# Altium schematic sheet 1_RX_Ultrasonic.schdoc
size 497 x 243 mm; SheetNumber: 1; SheetTotal: 2
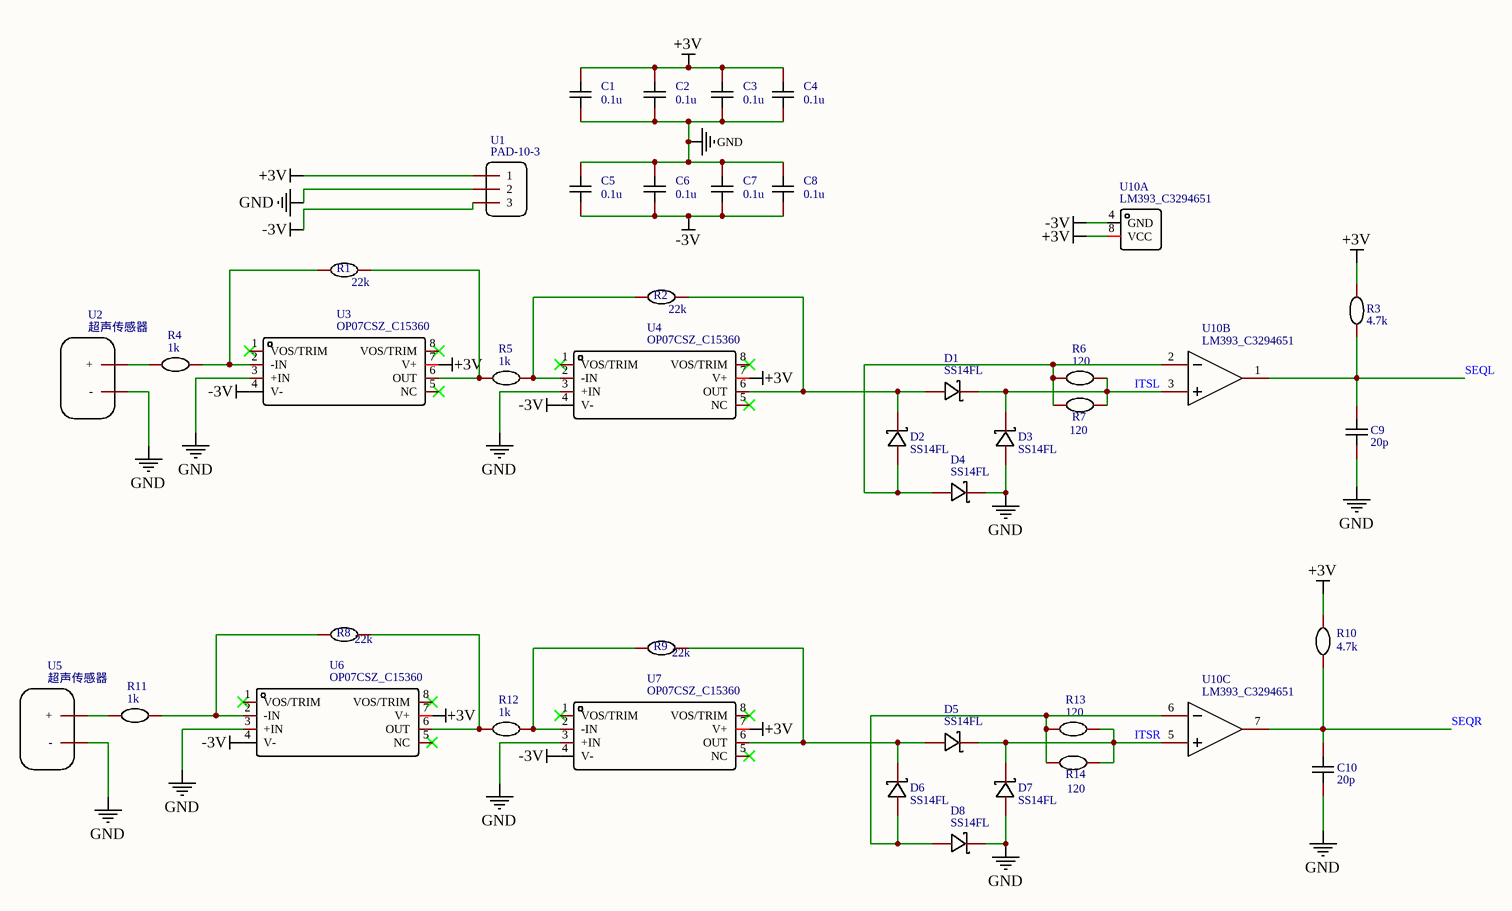
[diagram p0: 1_RX_Ultrasonic.schdoc]

## Parts
C1  0.1u  [C0603]
C2  0.1u  [C0603]
C3  0.1u  [C0603]
C4  0.1u  [C0603]
C5  0.1u  [C0603]
C6  0.1u  [C0603]
C7  0.1u  [C0603]
C8  0.1u  [C0603]
C9  20p  [C0603]
C10  20p  [C0603]
D1  SS14FL  [SMA_L4.4-W2.8-LS5.4-RD]
D2  SS14FL  [SMA_L4.4-W2.8-LS5.4-RD]
D3  SS14FL  [SMA_L4.4-W2.8-LS5.4-RD]
D4  SS14FL  [SMA_L4.4-W2.8-LS5.4-RD]
D5  SS14FL  [SMA_L4.4-W2.8-LS5.4-RD]
D6  SS14FL  [SMA_L4.4-W2.8-LS5.4-RD]
D7  SS14FL  [SMA_L4.4-W2.8-LS5.4-RD]
D8  SS14FL  [SMA_L4.4-W2.8-LS5.4-RD]
R1  22k  [R0603]
R2  22k  [R0603]
R3  4.7k  [R0603]
R4  1k  [R0603]
R5  1k  [R0603]
R6  120  [R0603]
R7  120  [R0603]
R8  22k  [R0603]
R9  22k  [R0603]
R10  4.7k  [R0603]
R11  1k  [R0603]
R12  1k  [R0603]
R13  120  [R0603]
R14  120  [R0603]
U1  PAD-10-3  [PAD-10-3]
U2  超声传感器  [超声传感器]
U3  Name: OP07CSZ_C15360  [SOIC-8_L4.9-W3.9-P1.27-LS6.0-BL]  (hidden comment: OP07CSZ)
U4  Name: OP07CSZ_C15360  [SOIC-8_L4.9-W3.9-P1.27-LS6.0-BL]  (hidden comment: OP07CSZ)
U5  超声传感器  [超声传感器]
U6  Name: OP07CSZ_C15360  [SOIC-8_L4.9-W3.9-P1.27-LS6.0-BL]  (hidden comment: OP07CSZ)
U7  Name: OP07CSZ_C15360  [SOIC-8_L4.9-W3.9-P1.27-LS6.0-BL]  (hidden comment: OP07CSZ)
U10  Name: LM393_C3294651  [SOP-8_L5.0-W4.0-P1.27-LS6.0-BL]  (hidden comment: LM393)  (parts A,B,C of 3)

## Nets
+3V: C1.1 C2.1 C3.1 C4.1 R3.1 R10.1 U1.1 U3.7(V+) U4.7(V+) U6.7(V+) U7.7(V+) U10.8(VCC)
-3V: C5.2 C6.2 C7.2 C8.2 U1.3 U3.4(V-) U4.4(V-) U6.4(V-) U7.4(V-) U10.4(GND)
GND: C1.2 C2.2 C3.2 C4.2 C5.1 C6.1 C7.1 C8.1 C9.1 C10.1 D3.2(A) D4.1(C) D7.2(A) D8.1(C) U1.2 U2.2(-) U3.3(+IN) U4.3(+IN) U5.2(-) U6.3(+IN) U7.3(+IN)
ITSL: D1.1(C) D3.1(C) R6.1 R7.2 U10.3(1IN+)
ITSR: D5.1(C) D7.1(C) R13.2 R14.2 U10.5(2IN+)
SEQL: C9.2 R3.2 U10.1(1OUT)
SEQR: C10.2 R10.2 U10.7(2OUT)
NetD1_2: D1.2(A) D2.1(C) R2.2 U4.6(OUT)
NetD2_2: D2.2(A) D4.2(A) R6.2 R7.1 U10.2(1IN-)
NetD5_2: D5.2(A) D6.1(C) R9.2 U7.6(OUT)
NetD6_2: D6.2(A) D8.2(A) R13.1 R14.1 U10.6(2IN-)
NetR1_1: R1.1 R4.2 U3.2(-IN)
NetR1_2: R1.2 R5.1 U3.6(OUT)
NetR2_1: R2.1 R5.2 U4.2(-IN)
NetR4_1: R4.1 U2.1(+)
NetR8_1: R8.1 R11.2 U6.2(-IN)
NetR8_2: R8.2 R12.1 U6.6(OUT)
NetR9_1: R9.1 R12.2 U7.2(-IN)
NetR11_1: R11.1 U5.1(+)

Not connected (* = marked no-connect by the designer): U3 1(VOS/TRIM)* 5(NC)* 8(VOS/TRIM)*; U4 1(VOS/TRIM)* 5(NC)* 8(VOS/TRIM)*; U6 1(VOS/TRIM)* 5(NC)* 8(VOS/TRIM)*; U7 1(VOS/TRIM)* 5(NC)* 8(VOS/TRIM)*

## Library data of the parts
C1 C5 = 0.1u: Convert to PCB: yes; Name: 0.1u; Symbol: 0.1u; Device: 0.1u; Add into BOM: yes; Origin Footprint: C0603
C2-C4 C6-C8 = 0.1u: Convert to PCB: yes; NAME: 2; Name: 0.1u; Symbol: 0.1u; Device: 0.1u; Add into BOM: yes; Origin Footprint: C0603; NUMBER: 2
C9 C10 = 20p: Convert to PCB: yes; Name: 20p; Symbol: 20p; Device: 20p; Add into BOM: yes; Origin Footprint: C0603
D1-D8 = SS14FL: Manufacturer: SK; Convert to PCB: yes; Name: SS14FL; Symbol: SS14FL; Device: SS14FL; Supplier: LCSC; Manufacturer Part: SS14FL; Supplier Part: C111580; JLCPCB Part Class: Extended Part; Add into BOM: yes; Origin Footprint: SMA_L4.4-W2.8-LS5.4-RD
R1 = 22k: Convert to PCB: yes; NAME: 1; Name: 22k; Symbol: 22k; Device: 22k; Add into BOM: yes; Origin Footprint: R0603; NUMBER: 1
R2 R8 R9 = 22k: Convert to PCB: yes; Name: 22k; Symbol: 22k; Device: 22k; Add into BOM: yes; Origin Footprint: R0603
R3 R10 = 4.7k: Convert to PCB: yes; Name: 4.7k; Symbol: 4.7k; Device: 4.7k; Add into BOM: yes; Origin Footprint: R0603
R4 R11 = 1k: Convert to PCB: yes; Name: 1k; Symbol: 1k; Device: 1k; Add into BOM: yes; Origin Footprint: R0603
R5 R12 = 1k: Convert to PCB: yes; NAME: 1; Name: 1k; Symbol: 1k; Device: 1k; Add into BOM: yes; Origin Footprint: R0603; NUMBER: 1
R6 R7 R13 R14 = 120: Convert to PCB: yes; Name: 120; Symbol: 120; Device: 120; Add into BOM: yes; Origin Footprint: R0603
U1 = PAD-10-3: Convert to PCB: yes; Name: PAD-10-3; Symbol: PAD-10-3; Device: PAD-10-3; Add into BOM: yes; Origin Footprint: PAD-10-3
U2 U5 = 超声传感器: Convert to PCB: yes; Name: 超声传感器; Symbol: 超声传感器; Device: 超声传感器; Add into BOM: yes; Origin Footprint: 超声传感器
U3 U4 U6 U7 = OP07CSZ: Manufacturer: ADI(亚德诺)/LINEAR; Convert to PCB: yes; Symbol: OP07CSZ_C15360; Device: OP07CSZ; Supplier: LCSC; Supplier Part: C15360; Manufacturer Part: OP07CSZ; JLCPCB Part Class: Extended Part; Add into BOM: yes; Origin Footprint: SOIC-8_L4.9-W3.9-P1.27-LS6.0-BL
U10 = LM393: Manufacturer: DOWO(东沃); Convert to PCB: yes; Symbol: LM393_C3294651; Device: LM393; Supplier: LCSC; Supplier Part: C3294651; Manufacturer Part: LM393; link: https://atta.szlcsc.com/upload/public/pdf/source/20220704/E08554B0B0F027380469CE4357F6D587.pdf; Add into BOM: yes; Origin Footprint: SOP-8_L5.0-W4.0-P1.27-LS6.0-BL